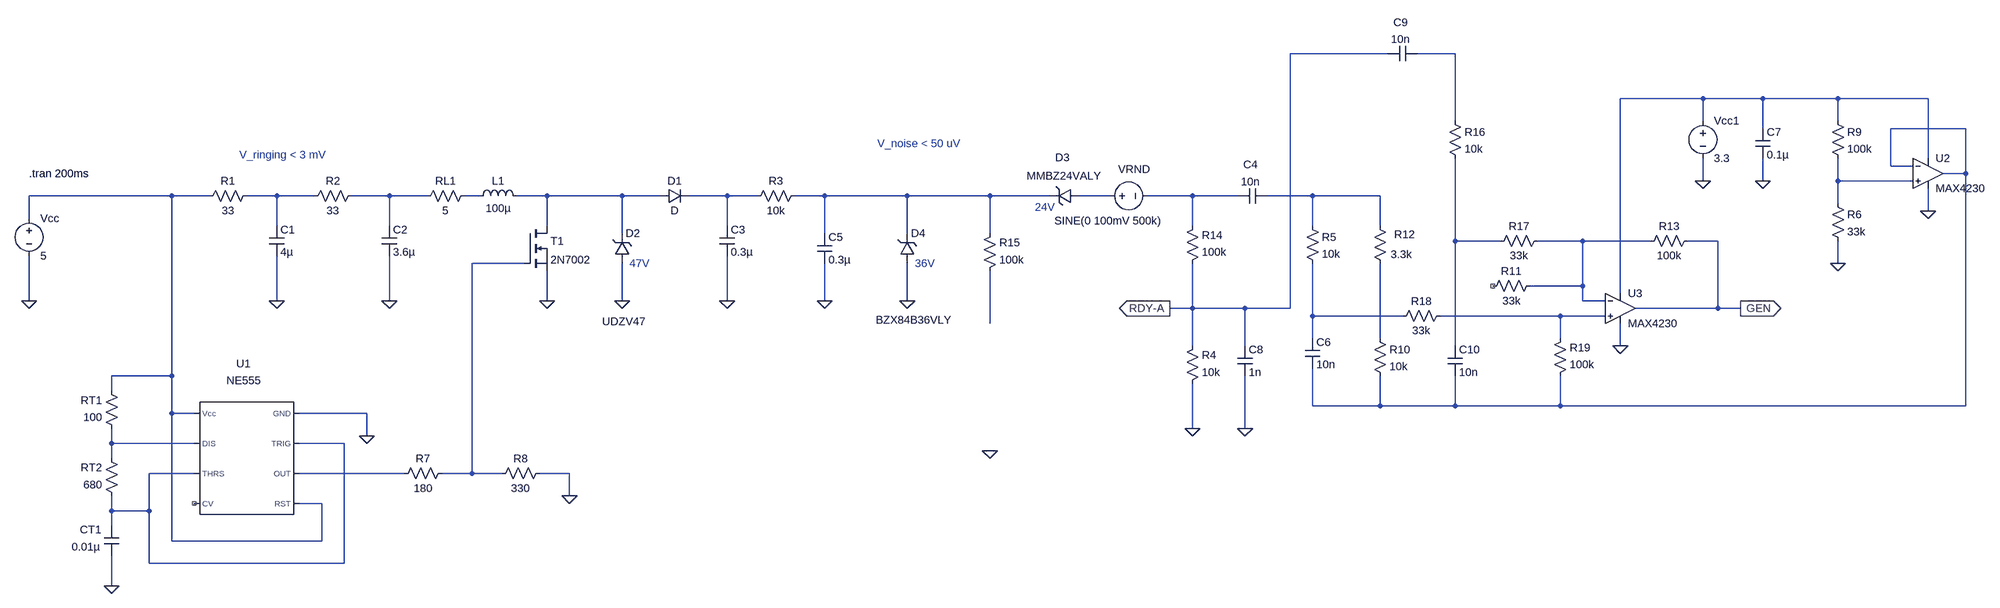
[diagram p0: schematic BoostPump9_WaveExtractor_diff_try.asc]
BoostPump9_WaveExtractor_diff_try.asc, the LTspice schematic file:
Version 4
SHEET 1 4340 772
WIRE 2192 -384 1984 -384
WIRE 2336 -384 2256 -384
WIRE 2864 -288 2688 -288
WIRE 2992 -288 2864 -288
WIRE 3152 -288 2992 -288
WIRE 3344 -288 3152 -288
WIRE 2336 -240 2336 -384
WIRE 2864 -240 2864 -288
WIRE 3152 -240 3152 -288
WIRE 2992 -224 2992 -288
WIRE 3424 -224 3264 -224
WIRE 3344 -160 3344 -288
WIRE 3264 -144 3264 -224
WIRE 3312 -144 3264 -144
WIRE 3424 -128 3424 -224
WIRE 3424 -128 3376 -128
WIRE 2864 -112 2864 -160
WIRE 2992 -112 2992 -160
WIRE 3152 -112 3152 -160
WIRE 3312 -112 3152 -112
WIRE -400 -80 -704 -80
WIRE -320 -80 -400 -80
WIRE -176 -80 -240 -80
WIRE -96 -80 -176 -80
WIRE 64 -80 -16 -80
WIRE 144 -80 64 -80
WIRE 256 -80 224 -80
WIRE 400 -80 336 -80
WIRE 560 -80 400 -80
WIRE 640 -80 560 -80
WIRE 784 -80 704 -80
WIRE 848 -80 784 -80
WIRE 992 -80 928 -80
WIRE 1168 -80 992 -80
WIRE 1344 -80 1168 -80
WIRE 1472 -80 1344 -80
WIRE 1600 -80 1536 -80
WIRE 1776 -80 1680 -80
WIRE 1872 -80 1776 -80
WIRE 2032 -80 1936 -80
WIRE 2176 -80 2032 -80
WIRE 3152 -64 3152 -112
WIRE 3344 -48 3344 -96
WIRE -704 -32 -704 -80
WIRE -176 -16 -176 -80
WIRE 64 -16 64 -80
WIRE 400 -16 400 -80
WIRE 784 -16 784 -80
WIRE 1776 -16 1776 -80
WIRE 2032 -16 2032 -80
WIRE 2176 -16 2176 -80
WIRE 560 0 560 -80
WIRE 992 0 992 -80
WIRE 1168 0 1168 -80
WIRE 1344 0 1344 -80
WIRE 2336 16 2336 -160
WIRE 2432 16 2336 16
WIRE 2608 16 2512 16
WIRE 2752 16 2608 16
WIRE 2896 16 2832 16
WIRE 352 64 240 64
WIRE 3152 64 3152 16
WIRE 2608 112 2608 16
WIRE 2608 112 2496 112
WIRE 2688 128 2688 -288
WIRE -704 144 -704 48
WIRE -176 144 -176 48
WIRE 64 144 64 48
WIRE 400 144 400 80
WIRE 560 144 560 64
WIRE 784 144 784 48
WIRE 992 144 992 64
WIRE 1168 144 1168 64
WIRE 2608 144 2608 112
WIRE 2656 144 2608 144
WIRE 1776 160 1776 64
WIRE 1776 160 1728 160
WIRE 1888 160 1776 160
WIRE 1984 160 1984 -384
WIRE 1984 160 1888 160
WIRE 2896 160 2896 16
WIRE 2896 160 2720 160
WIRE 2944 160 2896 160
WIRE 2032 176 2032 64
WIRE 2224 176 2032 176
WIRE 2560 176 2304 176
WIRE 2656 176 2560 176
WIRE 1344 192 1344 80
WIRE 2032 224 2032 176
WIRE 2176 224 2176 64
WIRE 2560 224 2560 176
WIRE 1776 240 1776 160
WIRE 1888 240 1888 160
WIRE 2336 240 2336 16
WIRE 2688 240 2688 192
WIRE -400 304 -400 -80
WIRE -400 304 -528 304
WIRE -528 336 -528 304
WIRE 2032 368 2032 288
WIRE 2176 368 2176 304
WIRE 2176 368 2032 368
WIRE 2336 368 2336 304
WIRE 2336 368 2176 368
WIRE 2560 368 2560 304
WIRE 2560 368 2336 368
WIRE 3424 368 3424 -128
WIRE 3424 368 2560 368
WIRE -400 384 -400 304
WIRE -352 384 -400 384
WIRE 16 384 -128 384
WIRE 1776 416 1776 320
WIRE 1888 416 1888 304
WIRE 16 432 16 384
WIRE -528 448 -528 416
WIRE -352 448 -528 448
WIRE -32 448 -128 448
WIRE -528 480 -528 448
WIRE -352 512 -448 512
WIRE 96 512 -128 512
WIRE 240 512 240 64
WIRE 240 512 176 512
WIRE 304 512 240 512
WIRE 448 512 384 512
WIRE 448 560 448 512
WIRE -80 576 -128 576
WIRE -528 592 -528 560
WIRE -448 592 -448 512
WIRE -448 592 -528 592
WIRE -528 624 -528 592
WIRE -400 656 -400 384
WIRE -80 656 -80 576
WIRE -80 656 -400 656
WIRE -448 704 -448 592
WIRE -32 704 -32 448
WIRE -32 704 -448 704
WIRE -528 752 -528 688
FLAG 64 144 0
FLAG 400 144 0
FLAG 784 144 0
FLAG -704 144 0
FLAG 1168 144 0
FLAG 992 144 0
FLAG -176 144 0
FLAG -528 752 0
FLAG 16 432 0
FLAG 448 560 0
FLAG 3152 64 0
FLAG 2688 240 0
FLAG 3344 -48 0
FLAG 2864 -112 0
FLAG 2992 -112 0
FLAG 2944 160 GEN
IOPIN 2944 160 Out
FLAG 1344 464 0
FLAG 1776 416 0
FLAG 560 144 0
FLAG 1728 160 RDY-A
IOPIN 1728 160 Out
FLAG 1888 416 0
SYMBOL res 0 -96 R90
WINDOW 0 0 56 VBottom 2
WINDOW 3 32 56 VTop 2
SYMATTR InstName R2
SYMATTR Value 33
SYMBOL res 240 -96 R90
WINDOW 0 0 56 VBottom 2
WINDOW 3 32 56 VTop 2
SYMATTR InstName RL1
SYMATTR Value 5
SYMBOL cap 48 -16 R0
SYMATTR InstName C2
SYMATTR Value 3.6µ
SYMBOL cap 768 -16 R0
SYMATTR InstName C3
SYMATTR Value 0.3µ
SYMBOL ind 240 -64 R270
WINDOW 0 32 56 VTop 2
WINDOW 3 5 56 VBottom 2
SYMATTR InstName L1
SYMATTR Value 100µ
SYMBOL diode 640 -64 R270
WINDOW 0 32 32 VTop 2
WINDOW 3 0 32 VBottom 2
SYMATTR InstName D1
SYMBOL nmos 352 -16 R0
SYMATTR InstName T1
SYMATTR Value 2N7002
SYMBOL voltage -704 -48 R0
WINDOW 123 0 0 Left 0
WINDOW 39 0 0 Left 0
SYMATTR InstName Vcc
SYMATTR Value 5
SYMBOL res 944 -96 R90
WINDOW 0 0 56 VBottom 2
WINDOW 3 32 56 VTop 2
SYMATTR InstName R3
SYMATTR Value 10k
SYMBOL zener 1536 -96 R90
WINDOW 0 -50 37 VBottom 2
WINDOW 3 -42 34 VTop 2
SYMATTR InstName D3
SYMATTR Value MMBZ24VALY
SYMBOL cap -192 -16 R0
SYMATTR InstName C1
SYMATTR Value 4µ
SYMBOL res -224 -96 R90
WINDOW 0 0 56 VBottom 2
WINDOW 3 32 56 VTop 2
SYMATTR InstName R1
SYMATTR Value 33
SYMBOL Misc\\NE555 -240 480 M0
WINDOW 0 7 -202 Center 2
WINDOW 3 6 -166 Center 2
SYMATTR InstName U1
SYMBOL cap -544 624 R0
WINDOW 0 -52 8 Left 2
WINDOW 3 -69 45 Left 2
SYMATTR InstName CT1
SYMATTR Value 0.01µ
SYMBOL res -512 576 R180
WINDOW 0 36 76 Left 2
WINDOW 3 36 40 Left 2
SYMATTR InstName RT2
SYMATTR Value 680
SYMBOL res 192 496 R90
WINDOW 0 0 56 VBottom 2
WINDOW 3 32 56 VTop 2
SYMATTR InstName R7
SYMATTR Value 180
SYMBOL res 400 496 R90
WINDOW 0 0 56 VBottom 2
WINDOW 3 32 56 VTop 2
SYMATTR InstName R8
SYMATTR Value 330
SYMBOL res -512 432 R180
WINDOW 0 36 76 Left 2
WINDOW 3 36 40 Left 2
SYMATTR InstName RT1
SYMATTR Value 100
SYMBOL zener 1152 64 M180
WINDOW 0 24 64 Left 2
WINDOW 3 -51 -121 Left 2
SYMATTR InstName D4
SYMATTR Value BZX84B36VLY
SYMBOL cap 976 0 R0
SYMATTR InstName C5
SYMATTR Value 0.3µ
SYMBOL voltage 1584 -80 M90
WINDOW 123 0 0 Left 0
WINDOW 39 0 0 Left 0
WINDOW 0 -57 101 VLeft 2
WINDOW 3 53 126 VLeft 2
SYMATTR InstName VRND
SYMATTR Value SINE(0 100mV 500k)
SYMBOL cap 1936 -96 R90
WINDOW 0 -35 36 VBottom 2
WINDOW 3 -30 36 VTop 2
SYMATTR InstName C4
SYMATTR Value 10n
SYMBOL res 2016 -32 R0
SYMATTR InstName R5
SYMATTR Value 10k
SYMBOL OpAmps\\MAX4230 3344 -192 R0
SYMATTR InstName U2
SYMBOL OpAmps\\MAX4230 2688 96 R0
SYMATTR InstName U3
SYMBOL res 3136 -80 R0
SYMATTR InstName R6
SYMATTR Value 33k
SYMBOL res 3136 -256 R0
SYMATTR InstName R9
SYMATTR Value 100k
SYMBOL res 2160 208 R0
SYMATTR InstName R10
SYMATTR Value 10k
SYMBOL res 2192 80 R180
WINDOW 0 -58 78 Left 2
WINDOW 3 -52 35 Left 2
SYMATTR InstName R12
SYMATTR Value 3.3k
SYMBOL res 2848 0 R90
WINDOW 0 0 56 VBottom 2
WINDOW 3 32 56 VTop 2
SYMATTR InstName R13
SYMATTR Value 100k
SYMBOL cap 2016 224 R0
SYMATTR InstName C6
SYMATTR Value 10n
SYMBOL voltage 2864 -256 R0
WINDOW 123 0 0 Left 0
WINDOW 39 0 0 Left 0
SYMATTR InstName Vcc1
SYMATTR Value 3.3
SYMBOL cap 2976 -224 R0
SYMATTR InstName C7
SYMATTR Value 0.1µ
SYMBOL res 1760 80 M180
WINDOW 0 36 76 Left 2
WINDOW 3 36 40 Left 2
SYMATTR InstName R14
SYMATTR Value 100k
SYMBOL res 1328 96 M180
WINDOW 0 36 76 Left 2
WINDOW 3 36 40 Left 2
SYMATTR InstName R15
SYMATTR Value 100k
SYMBOL zener 544 64 M180
WINDOW 0 24 64 Left 2
WINDOW 3 -26 -124 Left 2
SYMATTR InstName D2
SYMATTR Value UDZV47
SYMBOL res 1760 336 M180
WINDOW 0 36 76 Left 2
WINDOW 3 36 40 Left 2
SYMATTR InstName R4
SYMATTR Value 10k
SYMBOL cap 1872 240 R0
SYMATTR InstName C8
SYMATTR Value 1n
SYMBOL res 2512 96 R90
WINDOW 0 0 56 VBottom 2
WINDOW 3 32 56 VTop 2
SYMATTR InstName R11
SYMATTR Value 33k
SYMBOL cap 2256 -400 R90
WINDOW 0 -35 36 VBottom 2
WINDOW 3 -30 36 VTop 2
SYMATTR InstName C9
SYMATTR Value 10n
SYMBOL res 2528 0 R90
WINDOW 0 0 56 VBottom 2
WINDOW 3 32 56 VTop 2
SYMATTR InstName R17
SYMATTR Value 33k
SYMBOL res 2320 -256 R0
SYMATTR InstName R16
SYMATTR Value 10k
SYMBOL cap 2320 240 R0
SYMATTR InstName C10
SYMATTR Value 10n
SYMBOL res 2320 160 R90
WINDOW 0 0 56 VBottom 2
WINDOW 3 32 56 VTop 2
SYMATTR InstName R18
SYMATTR Value 33k
SYMBOL res 2544 320 M180
WINDOW 0 36 76 Left 2
WINDOW 3 36 40 Left 2
SYMATTR InstName R19
SYMATTR Value 100k
TEXT -704 -128 Left 2 !.tran 200ms
TEXT -256 -168 Left 2 ;V_ringing < 3 mV
TEXT 1104 -192 Left 2 ;V_noise < 50 uV
TEXT 576 64 Left 2 ;47V
TEXT 1184 64 Left 2 ;36V
TEXT 1440 -56 Left 2 ;24V

The netlist it stands for:
* BoostPump9_WaveExtractor_diff_try.asc
R2 N007 N006 33
RL1 N008 N007 5
C2 N007 0 3.6µ
C3 N010 0 0.3µ
L1 N008 N009 100µ
D1 N009 N010 D
M§T1 N009 N017 0 0 2N7002
Vcc N005 0 5
R3 N011 N010 10k
D3 N012 N011 MMBZ24VALY
C1 N006 0 4µ
R1 N006 N005 33
XU1 0 N023 N024 N005 NC_01 N023 N022 N005 NE555  ; pins GND TRIG OUT RST CV THRS DIS Vcc
CT1 N023 0 0.01µ
RT2 N023 N022 680
R7 N017 N024 180
R8 0 N017 330
RT1 N022 N005 100
D4 0 N011 BZX84B36VLY
C5 N011 0 0.3µ
VRND N012 N013 SINE(0 100mV 500k)
C4 N014 N013 10n
R5 N014 N018 10k
XU2 N004 N003 N002 0 N003 MAX4230  ; pins In+ In- V+ V- OUT
XU3 N019 N016 N002 0 GEN MAX4230  ; pins In+ In- V+ V- OUT
R6 N004 0 33k
R9 N002 N004 100k
R10 N021 N003 10k
R12 N021 N014 3.3k
R13 GEN N016 100k
C6 N018 N003 10n
Vcc1 N002 0 3.3
C7 N002 0 0.1µ
R14 RDY-A N013 100k
R15 N020 N011 100k
D2 0 N009 UDZV47
R4 0 RDY-A 10k
C8 RDY-A 0 1n
R11 N016 NC_02 33k
C9 N001 RDY-A 10n
R17 N016 N015 33k
R16 N001 N015 10k
C10 N015 N003 10n
R18 N019 N018 33k
R19 N003 N019 100k
.model D D
.lib standard.dio
.model NMOS NMOS
.model PMOS PMOS
.lib standard.mos
.tran 200ms
* V_ringing < 3 mV
* V_noise < 50 uV
* 47V
* 36V
* 24V
.lib NE555.sub
.lib MAX4230.lib
.backanno
.end